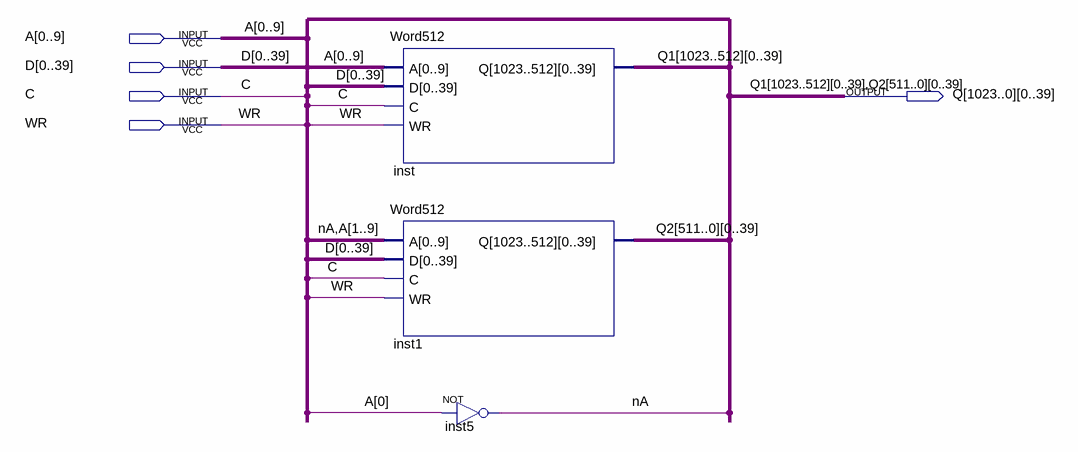
[diagram p0: schematic sheet]
// Quartus schematic Word1024.bdf as structural Verilog: 3 symbols, 5 pins
module Word1024 (
  input  [0:9] A,
  input  [0:39] D,
  input  C,
  input  WR,
  output [39:0] Q_1023,
  output [39:0] Q_1022,
  output [39:0] Q_1021,
  output [39:0] Q_1020,
  output [39:0] Q_1019,
  output [39:0] Q_1018,
  output [39:0] Q_1017,
  output [39:0] Q_1016,
  output [39:0] Q_1015,
  output [39:0] Q_1014,
  output [39:0] Q_1013,
  output [39:0] Q_1012,
  output [39:0] Q_1011,
  output [39:0] Q_1010,
  output [39:0] Q_1009,
  output [39:0] Q_1008,
  output [39:0] Q_1007,
  output [39:0] Q_1006,
  output [39:0] Q_1005,
  output [39:0] Q_1004,
  output [39:0] Q_1003,
  output [39:0] Q_1002,
  output [39:0] Q_1001,
  output [39:0] Q_1000,
  output [39:0] Q_999,
  output [39:0] Q_998,
  output [39:0] Q_997,
  output [39:0] Q_996,
  output [39:0] Q_995,
  output [39:0] Q_994,
  output [39:0] Q_993,
  output [39:0] Q_992,
  output [39:0] Q_991,
  output [39:0] Q_990,
  output [39:0] Q_989,
  output [39:0] Q_988,
  output [39:0] Q_987,
  output [39:0] Q_986,
  output [39:0] Q_985,
  output [39:0] Q_984,
  output [39:0] Q_983,
  output [39:0] Q_982,
  output [39:0] Q_981,
  output [39:0] Q_980,
  output [39:0] Q_979,
  output [39:0] Q_978,
  output [39:0] Q_977,
  output [39:0] Q_976,
  output [39:0] Q_975,
  output [39:0] Q_974,
  output [39:0] Q_973,
  output [39:0] Q_972,
  output [39:0] Q_971,
  output [39:0] Q_970,
  output [39:0] Q_969,
  output [39:0] Q_968,
  output [39:0] Q_967,
  output [39:0] Q_966,
  output [39:0] Q_965,
  output [39:0] Q_964,
  output [39:0] Q_963,
  output [39:0] Q_962,
  output [39:0] Q_961,
  output [39:0] Q_960,
  output [39:0] Q_959,
  output [39:0] Q_958,
  output [39:0] Q_957,
  output [39:0] Q_956,
  output [39:0] Q_955,
  output [39:0] Q_954,
  output [39:0] Q_953,
  output [39:0] Q_952,
  output [39:0] Q_951,
  output [39:0] Q_950,
  output [39:0] Q_949,
  output [39:0] Q_948,
  output [39:0] Q_947,
  output [39:0] Q_946,
  output [39:0] Q_945,
  output [39:0] Q_944,
  output [39:0] Q_943,
  output [39:0] Q_942,
  output [39:0] Q_941,
  output [39:0] Q_940,
  output [39:0] Q_939,
  output [39:0] Q_938,
  output [39:0] Q_937,
  output [39:0] Q_936,
  output [39:0] Q_935,
  output [39:0] Q_934,
  output [39:0] Q_933,
  output [39:0] Q_932,
  output [39:0] Q_931,
  output [39:0] Q_930,
  output [39:0] Q_929,
  output [39:0] Q_928,
  output [39:0] Q_927,
  output [39:0] Q_926,
  output [39:0] Q_925,
  output [39:0] Q_924,
  output [39:0] Q_923,
  output [39:0] Q_922,
  output [39:0] Q_921,
  output [39:0] Q_920,
  output [39:0] Q_919,
  output [39:0] Q_918,
  output [39:0] Q_917,
  output [39:0] Q_916,
  output [39:0] Q_915,
  output [39:0] Q_914,
  output [39:0] Q_913,
  output [39:0] Q_912,
  output [39:0] Q_911,
  output [39:0] Q_910,
  output [39:0] Q_909,
  output [39:0] Q_908,
  output [39:0] Q_907,
  output [39:0] Q_906,
  output [39:0] Q_905,
  output [39:0] Q_904,
  output [39:0] Q_903,
  output [39:0] Q_902,
  output [39:0] Q_901,
  output [39:0] Q_900,
  output [39:0] Q_899,
  output [39:0] Q_898,
  output [39:0] Q_897,
  output [39:0] Q_896,
  output [39:0] Q_895,
  output [39:0] Q_894,
  output [39:0] Q_893,
  output [39:0] Q_892,
  output [39:0] Q_891,
  output [39:0] Q_890,
  output [39:0] Q_889,
  output [39:0] Q_888,
  output [39:0] Q_887,
  output [39:0] Q_886,
  output [39:0] Q_885,
  output [39:0] Q_884,
  output [39:0] Q_883,
  output [39:0] Q_882,
  output [39:0] Q_881,
  output [39:0] Q_880,
  output [39:0] Q_879,
  output [39:0] Q_878,
  output [39:0] Q_877,
  output [39:0] Q_876,
  output [39:0] Q_875,
  output [39:0] Q_874,
  output [39:0] Q_873,
  output [39:0] Q_872,
  output [39:0] Q_871,
  output [39:0] Q_870,
  output [39:0] Q_869,
  output [39:0] Q_868,
  output [39:0] Q_867,
  output [39:0] Q_866,
  output [39:0] Q_865,
  output [39:0] Q_864,
  output [39:0] Q_863,
  output [39:0] Q_862,
  output [39:0] Q_861,
  output [39:0] Q_860,
  output [39:0] Q_859,
  output [39:0] Q_858,
  output [39:0] Q_857,
  output [39:0] Q_856,
  output [39:0] Q_855,
  output [39:0] Q_854,
  output [39:0] Q_853,
  output [39:0] Q_852,
  output [39:0] Q_851,
  output [39:0] Q_850,
  output [39:0] Q_849,
  output [39:0] Q_848,
  output [39:0] Q_847,
  output [39:0] Q_846,
  output [39:0] Q_845,
  output [39:0] Q_844,
  output [39:0] Q_843,
  output [39:0] Q_842,
  output [39:0] Q_841,
  output [39:0] Q_840,
  output [39:0] Q_839,
  output [39:0] Q_838,
  output [39:0] Q_837,
  output [39:0] Q_836,
  output [39:0] Q_835,
  output [39:0] Q_834,
  output [39:0] Q_833,
  output [39:0] Q_832,
  output [39:0] Q_831,
  output [39:0] Q_830,
  output [39:0] Q_829,
  output [39:0] Q_828,
  output [39:0] Q_827,
  output [39:0] Q_826,
  output [39:0] Q_825,
  output [39:0] Q_824,
  output [39:0] Q_823,
  output [39:0] Q_822,
  output [39:0] Q_821,
  output [39:0] Q_820,
  output [39:0] Q_819,
  output [39:0] Q_818,
  output [39:0] Q_817,
  output [39:0] Q_816,
  output [39:0] Q_815,
  output [39:0] Q_814,
  output [39:0] Q_813,
  output [39:0] Q_812,
  output [39:0] Q_811,
  output [39:0] Q_810,
  output [39:0] Q_809,
  output [39:0] Q_808,
  output [39:0] Q_807,
  output [39:0] Q_806,
  output [39:0] Q_805,
  output [39:0] Q_804,
  output [39:0] Q_803,
  output [39:0] Q_802,
  output [39:0] Q_801,
  output [39:0] Q_800,
  output [39:0] Q_799,
  output [39:0] Q_798,
  output [39:0] Q_797,
  output [39:0] Q_796,
  output [39:0] Q_795,
  output [39:0] Q_794,
  output [39:0] Q_793,
  output [39:0] Q_792,
  output [39:0] Q_791,
  output [39:0] Q_790,
  output [39:0] Q_789,
  output [39:0] Q_788,
  output [39:0] Q_787,
  output [39:0] Q_786,
  output [39:0] Q_785,
  output [39:0] Q_784,
  output [39:0] Q_783,
  output [39:0] Q_782,
  output [39:0] Q_781,
  output [39:0] Q_780,
  output [39:0] Q_779,
  output [39:0] Q_778,
  output [39:0] Q_777,
  output [39:0] Q_776,
  output [39:0] Q_775,
  output [39:0] Q_774,
  output [39:0] Q_773,
  output [39:0] Q_772,
  output [39:0] Q_771,
  output [39:0] Q_770,
  output [39:0] Q_769,
  output [39:0] Q_768,
  output [39:0] Q_767,
  output [39:0] Q_766,
  output [39:0] Q_765,
  output [39:0] Q_764,
  output [39:0] Q_763,
  output [39:0] Q_762,
  output [39:0] Q_761,
  output [39:0] Q_760,
  output [39:0] Q_759,
  output [39:0] Q_758,
  output [39:0] Q_757,
  output [39:0] Q_756,
  output [39:0] Q_755,
  output [39:0] Q_754,
  output [39:0] Q_753,
  output [39:0] Q_752,
  output [39:0] Q_751,
  output [39:0] Q_750,
  output [39:0] Q_749,
  output [39:0] Q_748,
  output [39:0] Q_747,
  output [39:0] Q_746,
  output [39:0] Q_745,
  output [39:0] Q_744,
  output [39:0] Q_743,
  output [39:0] Q_742,
  output [39:0] Q_741,
  output [39:0] Q_740,
  output [39:0] Q_739,
  output [39:0] Q_738,
  output [39:0] Q_737,
  output [39:0] Q_736,
  output [39:0] Q_735,
  output [39:0] Q_734,
  output [39:0] Q_733,
  output [39:0] Q_732,
  output [39:0] Q_731,
  output [39:0] Q_730,
  output [39:0] Q_729,
  output [39:0] Q_728,
  output [39:0] Q_727,
  output [39:0] Q_726,
  output [39:0] Q_725,
  output [39:0] Q_724,
  output [39:0] Q_723,
  output [39:0] Q_722,
  output [39:0] Q_721,
  output [39:0] Q_720,
  output [39:0] Q_719,
  output [39:0] Q_718,
  output [39:0] Q_717,
  output [39:0] Q_716,
  output [39:0] Q_715,
  output [39:0] Q_714,
  output [39:0] Q_713,
  output [39:0] Q_712,
  output [39:0] Q_711,
  output [39:0] Q_710,
  output [39:0] Q_709,
  output [39:0] Q_708,
  output [39:0] Q_707,
  output [39:0] Q_706,
  output [39:0] Q_705,
  output [39:0] Q_704,
  output [39:0] Q_703,
  output [39:0] Q_702,
  output [39:0] Q_701,
  output [39:0] Q_700,
  output [39:0] Q_699,
  output [39:0] Q_698,
  output [39:0] Q_697,
  output [39:0] Q_696,
  output [39:0] Q_695,
  output [39:0] Q_694,
  output [39:0] Q_693,
  output [39:0] Q_692,
  output [39:0] Q_691,
  output [39:0] Q_690,
  output [39:0] Q_689,
  output [39:0] Q_688,
  output [39:0] Q_687,
  output [39:0] Q_686,
  output [39:0] Q_685,
  output [39:0] Q_684,
  output [39:0] Q_683,
  output [39:0] Q_682,
  output [39:0] Q_681,
  output [39:0] Q_680,
  output [39:0] Q_679,
  output [39:0] Q_678,
  output [39:0] Q_677,
  output [39:0] Q_676,
  output [39:0] Q_675,
  output [39:0] Q_674,
  output [39:0] Q_673,
  output [39:0] Q_672,
  output [39:0] Q_671,
  output [39:0] Q_670,
  output [39:0] Q_669,
  output [39:0] Q_668,
  output [39:0] Q_667,
  output [39:0] Q_666,
  output [39:0] Q_665,
  output [39:0] Q_664,
  output [39:0] Q_663,
  output [39:0] Q_662,
  output [39:0] Q_661,
  output [39:0] Q_660,
  output [39:0] Q_659,
  output [39:0] Q_658,
  output [39:0] Q_657,
  output [39:0] Q_656,
  output [39:0] Q_655,
  output [39:0] Q_654,
  output [39:0] Q_653,
  output [39:0] Q_652,
  output [39:0] Q_651,
  output [39:0] Q_650,
  output [39:0] Q_649,
  output [39:0] Q_648,
  output [39:0] Q_647,
  output [39:0] Q_646,
  output [39:0] Q_645,
  output [39:0] Q_644,
  output [39:0] Q_643,
  output [39:0] Q_642,
  output [39:0] Q_641,
  output [39:0] Q_640,
  output [39:0] Q_639,
  output [39:0] Q_638,
  output [39:0] Q_637,
  output [39:0] Q_636,
  output [39:0] Q_635,
  output [39:0] Q_634,
  output [39:0] Q_633,
  output [39:0] Q_632,
  output [39:0] Q_631,
  output [39:0] Q_630,
  output [39:0] Q_629,
  output [39:0] Q_628,
  output [39:0] Q_627,
  output [39:0] Q_626,
  output [39:0] Q_625,
  output [39:0] Q_624,
  output [39:0] Q_623,
  output [39:0] Q_622,
  output [39:0] Q_621,
  output [39:0] Q_620,
  output [39:0] Q_619,
  output [39:0] Q_618,
  output [39:0] Q_617,
  output [39:0] Q_616,
  output [39:0] Q_615,
  output [39:0] Q_614,
  output [39:0] Q_613,
  output [39:0] Q_612,
  output [39:0] Q_611,
  output [39:0] Q_610,
  output [39:0] Q_609,
  output [39:0] Q_608,
  output [39:0] Q_607,
  output [39:0] Q_606,
  output [39:0] Q_605,
  output [39:0] Q_604,
  output [39:0] Q_603,
  output [39:0] Q_602,
  output [39:0] Q_601,
  output [39:0] Q_600,
  output [39:0] Q_599,
  output [39:0] Q_598,
  output [39:0] Q_597,
  output [39:0] Q_596,
  output [39:0] Q_595,
  output [39:0] Q_594,
  output [39:0] Q_593,
  output [39:0] Q_592,
  output [39:0] Q_591,
  output [39:0] Q_590,
  output [39:0] Q_589,
  output [39:0] Q_588,
  output [39:0] Q_587,
  output [39:0] Q_586,
  output [39:0] Q_585,
  output [39:0] Q_584,
  output [39:0] Q_583,
  output [39:0] Q_582,
  output [39:0] Q_581,
  output [39:0] Q_580,
  output [39:0] Q_579,
  output [39:0] Q_578,
  output [39:0] Q_577,
  output [39:0] Q_576,
  output [39:0] Q_575,
  output [39:0] Q_574,
  output [39:0] Q_573,
  output [39:0] Q_572,
  output [39:0] Q_571,
  output [39:0] Q_570,
  output [39:0] Q_569,
  output [39:0] Q_568,
  output [39:0] Q_567,
  output [39:0] Q_566,
  output [39:0] Q_565,
  output [39:0] Q_564,
  output [39:0] Q_563,
  output [39:0] Q_562,
  output [39:0] Q_561,
  output [39:0] Q_560,
  output [39:0] Q_559,
  output [39:0] Q_558,
  output [39:0] Q_557,
  output [39:0] Q_556,
  output [39:0] Q_555,
  output [39:0] Q_554,
  output [39:0] Q_553,
  output [39:0] Q_552,
  output [39:0] Q_551,
  output [39:0] Q_550,
  output [39:0] Q_549,
  output [39:0] Q_548,
  output [39:0] Q_547,
  output [39:0] Q_546,
  output [39:0] Q_545,
  output [39:0] Q_544,
  output [39:0] Q_543,
  output [39:0] Q_542,
  output [39:0] Q_541,
  output [39:0] Q_540,
  output [39:0] Q_539,
  output [39:0] Q_538,
  output [39:0] Q_537,
  output [39:0] Q_536,
  output [39:0] Q_535,
  output [39:0] Q_534,
  output [39:0] Q_533,
  output [39:0] Q_532,
  output [39:0] Q_531,
  output [39:0] Q_530,
  output [39:0] Q_529,
  output [39:0] Q_528,
  output [39:0] Q_527,
  output [39:0] Q_526,
  output [39:0] Q_525,
  output [39:0] Q_524,
  output [39:0] Q_523,
  output [39:0] Q_522,
  output [39:0] Q_521,
  output [39:0] Q_520,
  output [39:0] Q_519,
  output [39:0] Q_518,
  output [39:0] Q_517,
  output [39:0] Q_516,
  output [39:0] Q_515,
  output [39:0] Q_514,
  output [39:0] Q_513,
  output [39:0] Q_512,
  output [39:0] Q_511,
  output [39:0] Q_510,
  output [39:0] Q_509,
  output [39:0] Q_508,
  output [39:0] Q_507,
  output [39:0] Q_506,
  output [39:0] Q_505,
  output [39:0] Q_504,
  output [39:0] Q_503,
  output [39:0] Q_502,
  output [39:0] Q_501,
  output [39:0] Q_500,
  output [39:0] Q_499,
  output [39:0] Q_498,
  output [39:0] Q_497,
  output [39:0] Q_496,
  output [39:0] Q_495,
  output [39:0] Q_494,
  output [39:0] Q_493,
  output [39:0] Q_492,
  output [39:0] Q_491,
  output [39:0] Q_490,
  output [39:0] Q_489,
  output [39:0] Q_488,
  output [39:0] Q_487,
  output [39:0] Q_486,
  output [39:0] Q_485,
  output [39:0] Q_484,
  output [39:0] Q_483,
  output [39:0] Q_482,
  output [39:0] Q_481,
  output [39:0] Q_480,
  output [39:0] Q_479,
  output [39:0] Q_478,
  output [39:0] Q_477,
  output [39:0] Q_476,
  output [39:0] Q_475,
  output [39:0] Q_474,
  output [39:0] Q_473,
  output [39:0] Q_472,
  output [39:0] Q_471,
  output [39:0] Q_470,
  output [39:0] Q_469,
  output [39:0] Q_468,
  output [39:0] Q_467,
  output [39:0] Q_466,
  output [39:0] Q_465,
  output [39:0] Q_464,
  output [39:0] Q_463,
  output [39:0] Q_462,
  output [39:0] Q_461,
  output [39:0] Q_460,
  output [39:0] Q_459,
  output [39:0] Q_458,
  output [39:0] Q_457,
  output [39:0] Q_456,
  output [39:0] Q_455,
  output [39:0] Q_454,
  output [39:0] Q_453,
  output [39:0] Q_452,
  output [39:0] Q_451,
  output [39:0] Q_450,
  output [39:0] Q_449,
  output [39:0] Q_448,
  output [39:0] Q_447,
  output [39:0] Q_446,
  output [39:0] Q_445,
  output [39:0] Q_444,
  output [39:0] Q_443,
  output [39:0] Q_442,
  output [39:0] Q_441,
  output [39:0] Q_440,
  output [39:0] Q_439,
  output [39:0] Q_438,
  output [39:0] Q_437,
  output [39:0] Q_436,
  output [39:0] Q_435,
  output [39:0] Q_434,
  output [39:0] Q_433,
  output [39:0] Q_432,
  output [39:0] Q_431,
  output [39:0] Q_430,
  output [39:0] Q_429,
  output [39:0] Q_428,
  output [39:0] Q_427,
  output [39:0] Q_426,
  output [39:0] Q_425,
  output [39:0] Q_424,
  output [39:0] Q_423,
  output [39:0] Q_422,
  output [39:0] Q_421,
  output [39:0] Q_420,
  output [39:0] Q_419,
  output [39:0] Q_418,
  output [39:0] Q_417,
  output [39:0] Q_416,
  output [39:0] Q_415,
  output [39:0] Q_414,
  output [39:0] Q_413,
  output [39:0] Q_412,
  output [39:0] Q_411,
  output [39:0] Q_410,
  output [39:0] Q_409,
  output [39:0] Q_408,
  output [39:0] Q_407,
  output [39:0] Q_406,
  output [39:0] Q_405,
  output [39:0] Q_404,
  output [39:0] Q_403,
  output [39:0] Q_402,
  output [39:0] Q_401,
  output [39:0] Q_400,
  output [39:0] Q_399,
  output [39:0] Q_398,
  output [39:0] Q_397,
  output [39:0] Q_396,
  output [39:0] Q_395,
  output [39:0] Q_394,
  output [39:0] Q_393,
  output [39:0] Q_392,
  output [39:0] Q_391,
  output [39:0] Q_390,
  output [39:0] Q_389,
  output [39:0] Q_388,
  output [39:0] Q_387,
  output [39:0] Q_386,
  output [39:0] Q_385,
  output [39:0] Q_384,
  output [39:0] Q_383,
  output [39:0] Q_382,
  output [39:0] Q_381,
  output [39:0] Q_380,
  output [39:0] Q_379,
  output [39:0] Q_378,
  output [39:0] Q_377,
  output [39:0] Q_376,
  output [39:0] Q_375,
  output [39:0] Q_374,
  output [39:0] Q_373,
  output [39:0] Q_372,
  output [39:0] Q_371,
  output [39:0] Q_370,
  output [39:0] Q_369,
  output [39:0] Q_368,
  output [39:0] Q_367,
  output [39:0] Q_366,
  output [39:0] Q_365,
  output [39:0] Q_364,
  output [39:0] Q_363,
  output [39:0] Q_362,
  output [39:0] Q_361,
  output [39:0] Q_360,
  output [39:0] Q_359,
  output [39:0] Q_358,
  output [39:0] Q_357,
  output [39:0] Q_356,
  output [39:0] Q_355,
  output [39:0] Q_354,
  output [39:0] Q_353,
  output [39:0] Q_352,
  output [39:0] Q_351,
  output [39:0] Q_350,
  output [39:0] Q_349,
  output [39:0] Q_348,
  output [39:0] Q_347,
  output [39:0] Q_346,
  output [39:0] Q_345,
  output [39:0] Q_344,
  output [39:0] Q_343,
  output [39:0] Q_342,
  output [39:0] Q_341,
  output [39:0] Q_340,
  output [39:0] Q_339,
  output [39:0] Q_338,
  output [39:0] Q_337,
  output [39:0] Q_336,
  output [39:0] Q_335,
  output [39:0] Q_334,
  output [39:0] Q_333,
  output [39:0] Q_332,
  output [39:0] Q_331,
  output [39:0] Q_330,
  output [39:0] Q_329,
  output [39:0] Q_328,
  output [39:0] Q_327,
  output [39:0] Q_326,
  output [39:0] Q_325,
  output [39:0] Q_324,
  output [39:0] Q_323,
  output [39:0] Q_322,
  output [39:0] Q_321,
  output [39:0] Q_320,
  output [39:0] Q_319,
  output [39:0] Q_318,
  output [39:0] Q_317,
  output [39:0] Q_316,
  output [39:0] Q_315,
  output [39:0] Q_314,
  output [39:0] Q_313,
  output [39:0] Q_312,
  output [39:0] Q_311,
  output [39:0] Q_310,
  output [39:0] Q_309,
  output [39:0] Q_308,
  output [39:0] Q_307,
  output [39:0] Q_306,
  output [39:0] Q_305,
  output [39:0] Q_304,
  output [39:0] Q_303,
  output [39:0] Q_302,
  output [39:0] Q_301,
  output [39:0] Q_300,
  output [39:0] Q_299,
  output [39:0] Q_298,
  output [39:0] Q_297,
  output [39:0] Q_296,
  output [39:0] Q_295,
  output [39:0] Q_294,
  output [39:0] Q_293,
  output [39:0] Q_292,
  output [39:0] Q_291,
  output [39:0] Q_290,
  output [39:0] Q_289,
  output [39:0] Q_288,
  output [39:0] Q_287,
  output [39:0] Q_286,
  output [39:0] Q_285,
  output [39:0] Q_284,
  output [39:0] Q_283,
  output [39:0] Q_282,
  output [39:0] Q_281,
  output [39:0] Q_280,
  output [39:0] Q_279,
  output [39:0] Q_278,
  output [39:0] Q_277,
  output [39:0] Q_276,
  output [39:0] Q_275,
  output [39:0] Q_274,
  output [39:0] Q_273,
  output [39:0] Q_272,
  output [39:0] Q_271,
  output [39:0] Q_270,
  output [39:0] Q_269,
  output [39:0] Q_268,
  output [39:0] Q_267,
  output [39:0] Q_266,
  output [39:0] Q_265,
  output [39:0] Q_264,
  output [39:0] Q_263,
  output [39:0] Q_262,
  output [39:0] Q_261,
  output [39:0] Q_260,
  output [39:0] Q_259,
  output [39:0] Q_258,
  output [39:0] Q_257,
  output [39:0] Q_256,
  output [39:0] Q_255,
  output [39:0] Q_254,
  output [39:0] Q_253,
  output [39:0] Q_252,
  output [39:0] Q_251,
  output [39:0] Q_250,
  output [39:0] Q_249,
  output [39:0] Q_248,
  output [39:0] Q_247,
  output [39:0] Q_246,
  output [39:0] Q_245,
  output [39:0] Q_244,
  output [39:0] Q_243,
  output [39:0] Q_242,
  output [39:0] Q_241,
  output [39:0] Q_240,
  output [39:0] Q_239,
  output [39:0] Q_238,
  output [39:0] Q_237,
  output [39:0] Q_236,
  output [39:0] Q_235,
  output [39:0] Q_234,
  output [39:0] Q_233,
  output [39:0] Q_232,
  output [39:0] Q_231,
  output [39:0] Q_230,
  output [39:0] Q_229,
  output [39:0] Q_228,
  output [39:0] Q_227,
  output [39:0] Q_226,
  output [39:0] Q_225,
  output [39:0] Q_224,
  output [39:0] Q_223,
  output [39:0] Q_222,
  output [39:0] Q_221,
  output [39:0] Q_220,
  output [39:0] Q_219,
  output [39:0] Q_218,
  output [39:0] Q_217,
  output [39:0] Q_216,
  output [39:0] Q_215,
  output [39:0] Q_214,
  output [39:0] Q_213,
  output [39:0] Q_212,
  output [39:0] Q_211,
  output [39:0] Q_210,
  output [39:0] Q_209,
  output [39:0] Q_208,
  output [39:0] Q_207,
  output [39:0] Q_206,
  output [39:0] Q_205,
  output [39:0] Q_204,
  output [39:0] Q_203,
  output [39:0] Q_202,
  output [39:0] Q_201,
  output [39:0] Q_200,
  output [39:0] Q_199,
  output [39:0] Q_198,
  output [39:0] Q_197,
  output [39:0] Q_196,
  output [39:0] Q_195,
  output [39:0] Q_194,
  output [39:0] Q_193,
  output [39:0] Q_192,
  output [39:0] Q_191,
  output [39:0] Q_190,
  output [39:0] Q_189,
  output [39:0] Q_188,
  output [39:0] Q_187,
  output [39:0] Q_186,
  output [39:0] Q_185,
  output [39:0] Q_184,
  output [39:0] Q_183,
  output [39:0] Q_182,
  output [39:0] Q_181,
  output [39:0] Q_180,
  output [39:0] Q_179,
  output [39:0] Q_178,
  output [39:0] Q_177,
  output [39:0] Q_176,
  output [39:0] Q_175,
  output [39:0] Q_174,
  output [39:0] Q_173,
  output [39:0] Q_172,
  output [39:0] Q_171,
  output [39:0] Q_170,
  output [39:0] Q_169,
  output [39:0] Q_168,
  output [39:0] Q_167,
  output [39:0] Q_166,
  output [39:0] Q_165,
  output [39:0] Q_164,
  output [39:0] Q_163,
  output [39:0] Q_162,
  output [39:0] Q_161,
  output [39:0] Q_160,
  output [39:0] Q_159,
  output [39:0] Q_158,
  output [39:0] Q_157,
  output [39:0] Q_156,
  output [39:0] Q_155,
  output [39:0] Q_154,
  output [39:0] Q_153,
  output [39:0] Q_152,
  output [39:0] Q_151,
  output [39:0] Q_150,
  output [39:0] Q_149,
  output [39:0] Q_148,
  output [39:0] Q_147,
  output [39:0] Q_146,
  output [39:0] Q_145,
  output [39:0] Q_144,
  output [39:0] Q_143,
  output [39:0] Q_142,
  output [39:0] Q_141,
  output [39:0] Q_140,
  output [39:0] Q_139,
  output [39:0] Q_138,
  output [39:0] Q_137,
  output [39:0] Q_136,
  output [39:0] Q_135,
  output [39:0] Q_134,
  output [39:0] Q_133,
  output [39:0] Q_132,
  output [39:0] Q_131,
  output [39:0] Q_130,
  output [39:0] Q_129,
  output [39:0] Q_128,
  output [39:0] Q_127,
  output [39:0] Q_126,
  output [39:0] Q_125,
  output [39:0] Q_124,
  output [39:0] Q_123,
  output [39:0] Q_122,
  output [39:0] Q_121,
  output [39:0] Q_120,
  output [39:0] Q_119,
  output [39:0] Q_118,
  output [39:0] Q_117,
  output [39:0] Q_116,
  output [39:0] Q_115,
  output [39:0] Q_114,
  output [39:0] Q_113,
  output [39:0] Q_112,
  output [39:0] Q_111,
  output [39:0] Q_110,
  output [39:0] Q_109,
  output [39:0] Q_108,
  output [39:0] Q_107,
  output [39:0] Q_106,
  output [39:0] Q_105,
  output [39:0] Q_104,
  output [39:0] Q_103,
  output [39:0] Q_102,
  output [39:0] Q_101,
  output [39:0] Q_100,
  output [39:0] Q_99,
  output [39:0] Q_98,
  output [39:0] Q_97,
  output [39:0] Q_96,
  output [39:0] Q_95,
  output [39:0] Q_94,
  output [39:0] Q_93,
  output [39:0] Q_92,
  output [39:0] Q_91,
  output [39:0] Q_90,
  output [39:0] Q_89,
  output [39:0] Q_88,
  output [39:0] Q_87,
  output [39:0] Q_86,
  output [39:0] Q_85,
  output [39:0] Q_84,
  output [39:0] Q_83,
  output [39:0] Q_82,
  output [39:0] Q_81,
  output [39:0] Q_80,
  output [39:0] Q_79,
  output [39:0] Q_78,
  output [39:0] Q_77,
  output [39:0] Q_76,
  output [39:0] Q_75,
  output [39:0] Q_74,
  output [39:0] Q_73,
  output [39:0] Q_72,
  output [39:0] Q_71,
  output [39:0] Q_70,
  output [39:0] Q_69,
  output [39:0] Q_68,
  output [39:0] Q_67,
  output [39:0] Q_66,
  output [39:0] Q_65,
  output [39:0] Q_64,
  output [39:0] Q_63,
  output [39:0] Q_62,
  output [39:0] Q_61,
  output [39:0] Q_60,
  output [39:0] Q_59,
  output [39:0] Q_58,
  output [39:0] Q_57,
  output [39:0] Q_56,
  output [39:0] Q_55,
  output [39:0] Q_54,
  output [39:0] Q_53,
  output [39:0] Q_52,
  output [39:0] Q_51,
  output [39:0] Q_50,
  output [39:0] Q_49,
  output [39:0] Q_48,
  output [39:0] Q_47,
  output [39:0] Q_46,
  output [39:0] Q_45,
  output [39:0] Q_44,
  output [39:0] Q_43,
  output [39:0] Q_42,
  output [39:0] Q_41,
  output [39:0] Q_40,
  output [39:0] Q_39,
  output [39:0] Q_38,
  output [39:0] Q_37,
  output [39:0] Q_36,
  output [39:0] Q_35,
  output [39:0] Q_34,
  output [39:0] Q_33,
  output [39:0] Q_32,
  output [39:0] Q_31,
  output [39:0] Q_30,
  output [39:0] Q_29,
  output [39:0] Q_28,
  output [39:0] Q_27,
  output [39:0] Q_26,
  output [39:0] Q_25,
  output [39:0] Q_24,
  output [39:0] Q_23,
  output [39:0] Q_22,
  output [39:0] Q_21,
  output [39:0] Q_20,
  output [39:0] Q_19,
  output [39:0] Q_18,
  output [39:0] Q_17,
  output [39:0] Q_16,
  output [39:0] Q_15,
  output [39:0] Q_14,
  output [39:0] Q_13,
  output [39:0] Q_12,
  output [39:0] Q_11,
  output [39:0] Q_10,
  output [39:0] Q_9,
  output [39:0] Q_8,
  output [39:0] Q_7,
  output [39:0] Q_6,
  output [39:0] Q_5,
  output [39:0] Q_4,
  output [39:0] Q_3,
  output [39:0] Q_2,
  output [39:0] Q_1,
  output [39:0] Q_0
);

  wire nA;
